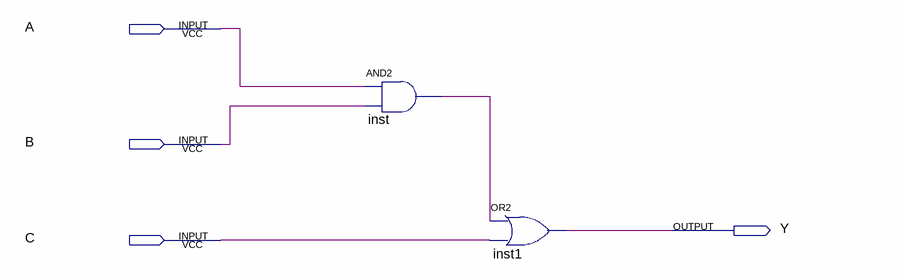
[diagram p0: schematic sheet]
// Quartus schematic homework2.bdf as structural Verilog: 2 symbols, 4 pins
module homework2 (
  input  A,
  input  B,
  input  C,
  output Y
);

  wire inst_out;

  and inst (inst_out, A, B);
  or inst1 (Y, inst_out, C);
endmodule
